# EAGLE design Hatch2021Badge0805_1 (EAGLE 9.6.2)
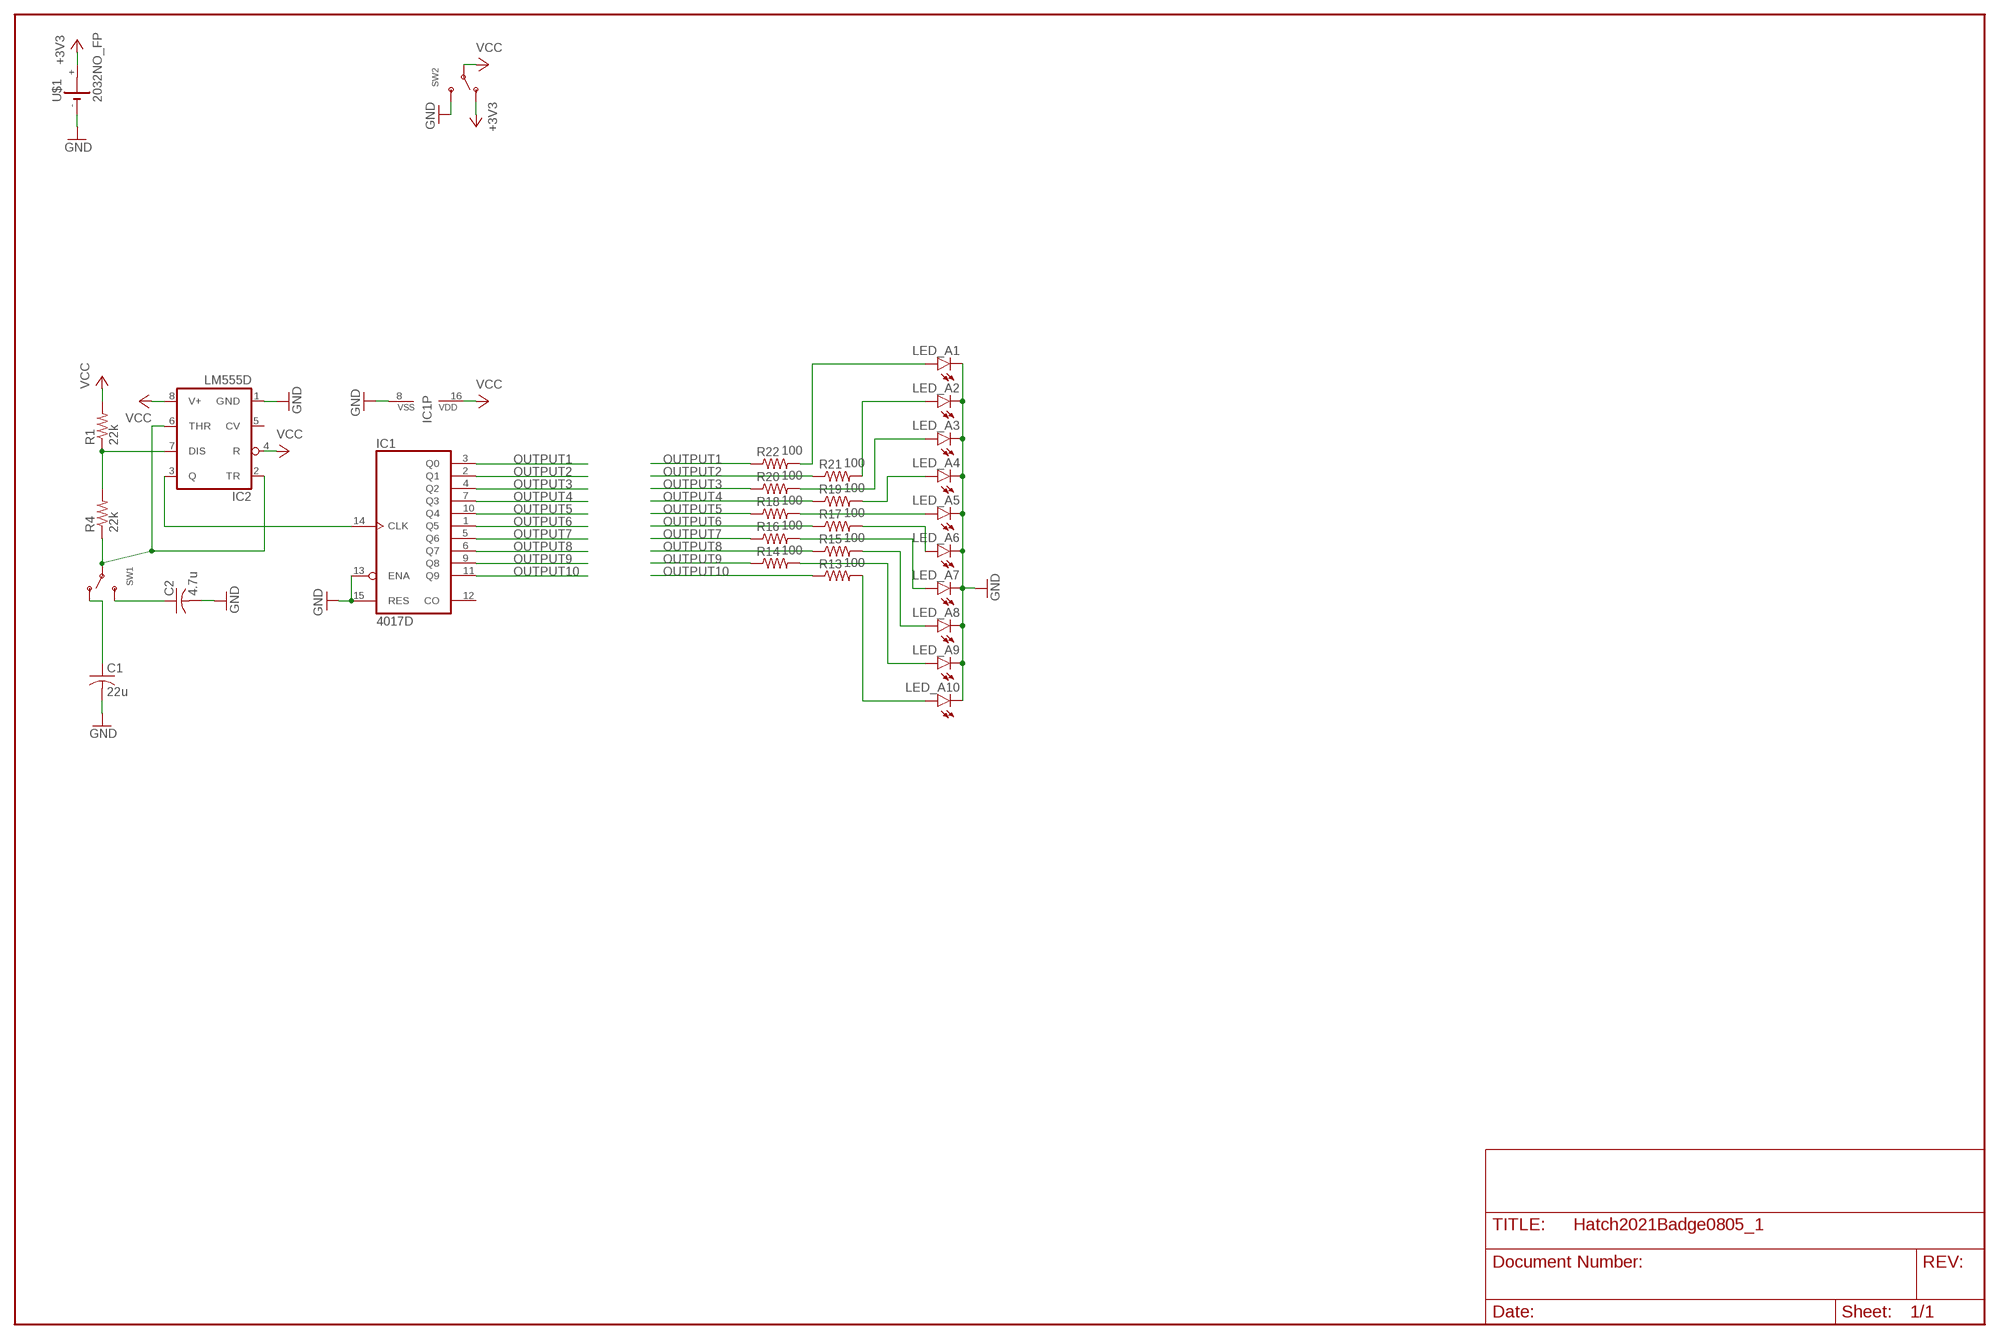
[diagram p0: schematic, sheet 1]

## Parts
C1  22u  C-USC0805  [C0805]
C2  4.7u  C-USC0805  [C0805]
IC1  4017D  [SO16]
IC2  LM555D  [SO08]
LED_A1  LEDSML0805  [SML0805]
LED_A2  LEDSML0805  [SML0805]
LED_A3  LEDSML0805  [SML0805]
LED_A4  LEDSML0805  [SML0805]
LED_A5  LEDSML0805  [SML0805]
LED_A6  LEDSML0805  [SML0805]
LED_A7  LEDSML0805  [SML0805]
LED_A8  LEDSML0805  [SML0805]
LED_A9  LEDSML0805  [SML0805]
LED_A10  LEDSML0805  [SML0805]
R1  22k  R-US_R0805  [R0805]
R4  22k  R-US_R0805  [R0805]
R13  100  R-US_R0805  [R0805]
R14  100  R-US_R0805  [R0805]
R15  100  R-US_R0805  [R0805]
R16  100  R-US_R0805  [R0805]
R17  100  R-US_R0805  [R0805]
R18  100  R-US_R0805  [R0805]
R19  100  R-US_R0805  [R0805]
R20  100  R-US_R0805  [R0805]
R21  100  R-US_R0805  [R0805]
R22  100  R-US_R0805  [R0805]
SW1  SWITCH_SPDT  [SPDT_SMT_SSSS811101]
SW2  SWITCH_SPDT  [SPDT_SMT_SSSS811101]
U$1  2032NO_FP  [2032_NO_FP]

## Nets
+3V3 [5V]: SW2.A(O) U$1.+
GND [5V]: C1.2 C2.2 IC1.8(VSS) IC1.13(ENA) IC1.15(RES) IC2.1(GND) LED_A1.C LED_A2.C LED_A3.C LED_A4.C LED_A5.C LED_A6.C LED_A7.C LED_A8.C LED_A9.C LED_A10.C SW2.C(S) U$1.-
N$1: IC2.7(DIS) R1.1 R4.2
N$2: LED_A2.A R21.2
N$3: LED_A3.A R20.2
N$4: C1.1 SW1.A(O)
N$5: C2.1 SW1.C(S)
N$15: LED_A1.A R22.2
N$16: LED_A4.A R19.2
N$17: LED_A5.A R18.2
N$18: LED_A6.A R17.2
N$19: LED_A7.A R16.2
N$20: LED_A8.A R15.2
N$21: LED_A9.A R14.2
N$22: LED_A10.A R13.2
N$67: IC2.2(TR) IC2.6(THR) R4.1 SW1.B(P)
N$68: IC1.14(CLK) IC2.3(Q)
OUTPUT1: IC1.3(Q0) R22.1
OUTPUT2: IC1.2(Q1) R21.1
OUTPUT3: IC1.4(Q2) R20.1
OUTPUT4: IC1.7(Q3) R19.1
OUTPUT5: IC1.10(Q4) R18.1
OUTPUT6: IC1.1(Q5) R17.1
OUTPUT7: IC1.5(Q6) R16.1
OUTPUT8: IC1.6(Q7) R15.1
OUTPUT9: IC1.9(Q8) R14.1
OUTPUT10: IC1.11(Q9) R13.1
VCC [5V]: IC1.16(VDD) IC2.4(R) IC2.8(V+) R1.2 SW2.B(P)
Unconnected: IC1.12(CO) IC2.5(CV)

## Library data of the parts
C1 C2 = rcl:C-US: CAPACITOR, American symbol; SPICEPREFIX: C
IC1 = 40xx:4017: COUNTER/DIVIDER
IC2 = adafruit:*555: TIMER Changed DIP package to have round (not oval) pin pads http://www.ladyada.net/library/pcb/eaglelibrary.html
LED_A1-LED_A10 = led:LED: LED OSRAM: - CHIPLED LG R971, LG N971, LY N971, LG Q971, LY Q971, LO R971, LY R971 LH N974, LH R974 LS Q976, LO Q976, LY Q976 LO Q996 - Hyper CHIPLED LW Q18S LB Q993, LB Q99A, LB R99A - SideLED LS A670, LO A670, LY A670, LG A670, LP A670 LB A673, LV A673, LT A673, LW A673 LH A674 LY A675 LS A676, LA A676, LO A676, LY A676, LW A676 LS A679, LY A679, LG A679 - Hyper Micro SIDELED® LS Y876, LA Y876, LO Y876, LY Y876 LT Y87S - SmartLED LW L88C, LW L88S LB L89C, LB L89S, LG L890 LS L89K, LO L89K, LY L89K LS L896, LA L896, LO L896, LY L896 - TOPLED LS T670, LO T670, LY T670, LG T670, LP T670 LSG T670, LSP T670, LSY T670, LOP T670, LYG T670 LG T671, LOG T671, LSG T671 LB T673, LV T673, LT T673, LW T673 LH T674 LS T676, LA T676, LO T676, LY T676, LB T676, LH T676, LSB T676, LW T676 LB T67C, LV T67C, LT T67C, LS T67K, LO T67K, LY T67K, LW E67C LS E67B, LA E67B, LO E67B, LY E67B, LB E67C, LV E67C, LT E67C LW T67C LS T679, LY T679, LG T679 LS T770, LO T770, LY T770, LG T770, LP T770 LB T773, LV T773, LT T773, LW T773 LH T774 LS E675, LA E675, LY E675, LS T675 LS T776, LA T776, LO T776, LY T776, LB T776 LHGB T686 LT T68C, LB T68C - Hyper Mini TOPLED® LB M676 - Mini TOPLED Santana® LG M470 LS M47K, LO M47K, LY M47K Source: http://www.osram.convergy.de LUXEON: - LUMILED® LXK2-PW12-R00, LXK2-PW12-S00, LXK2-PW14-U00, LXK2-PW14-V00 LXK2-PM12-R00, LXK2-PM12-S00, LXK2-PM14-U00 LXK2-PE12-Q00, LXK2-PE12-R00, LXK2-PE12-S00, LXK2-PE14-T00, LXK2-PE14-U00 LXK2-PB12-K00, LXK2-PB12-L00, LXK2-PB12-M00, LXK2-PB14-N00, LXK2-PB14-P00, LXK2-PB14-Q00 LXK2-PR12-L00, LXK2-PR12-M00, LXK2-PR14-Q00, LXK2-PR14-R00 LXK2-PD12-Q00, LXK2-PD12-R00, LXK2-PD12-S00 LXK2-PH12-R00, LXK2-PH12-S00 LXK2-PL12-P00, LXK2-PL12-Q00, LXK2-PL12-R00 Source: www.luxeon.com KINGBRIGHT: KA-3528ASYC Source: www.kingbright.com
R1 R4 R13-R22 = rcl:R-US_: RESISTOR, American symbol; SPICEPREFIX: R
SW1 SW2 = microbuilder:SWITCH_SPDT: Switch - SPDT SSSS811101 - Horizontal Two Position SMT, 0.3A 4V [Mouser: 688-SSSS811101]
U$1 = Hatch2020:2032

## Net classes
1 vee: width 0.508 mm
2 5V: width 0.508 mm

## Board
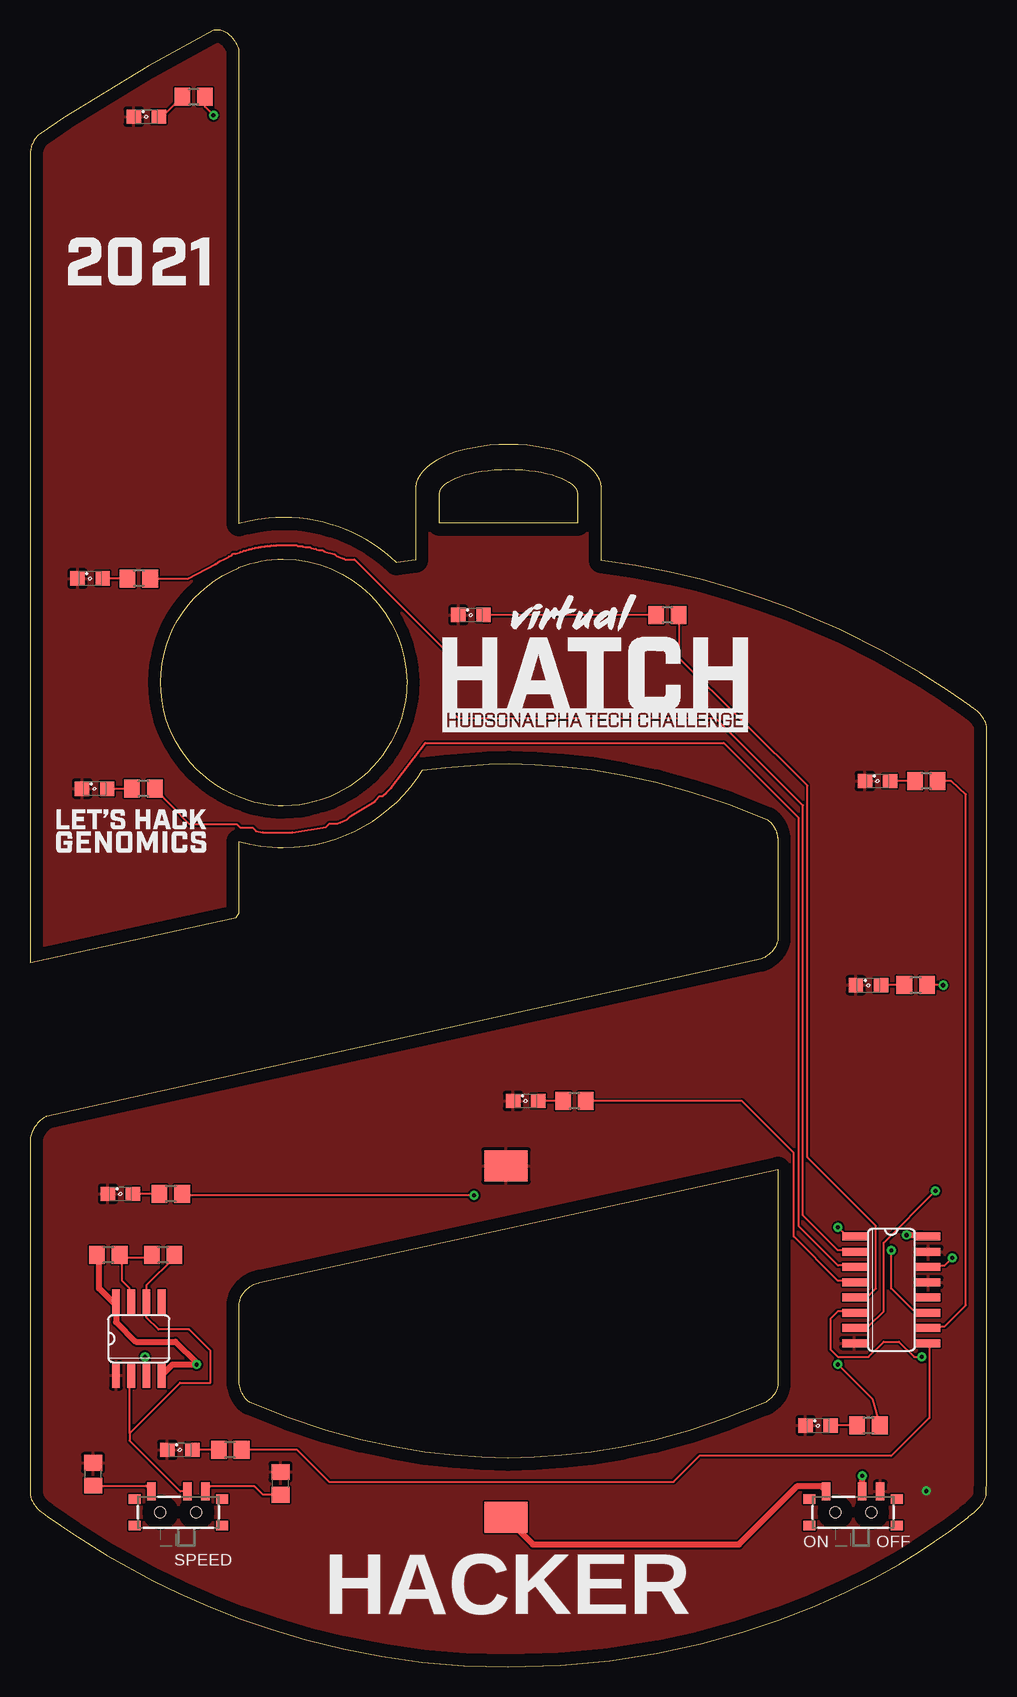
[diagram p1: board, top side]
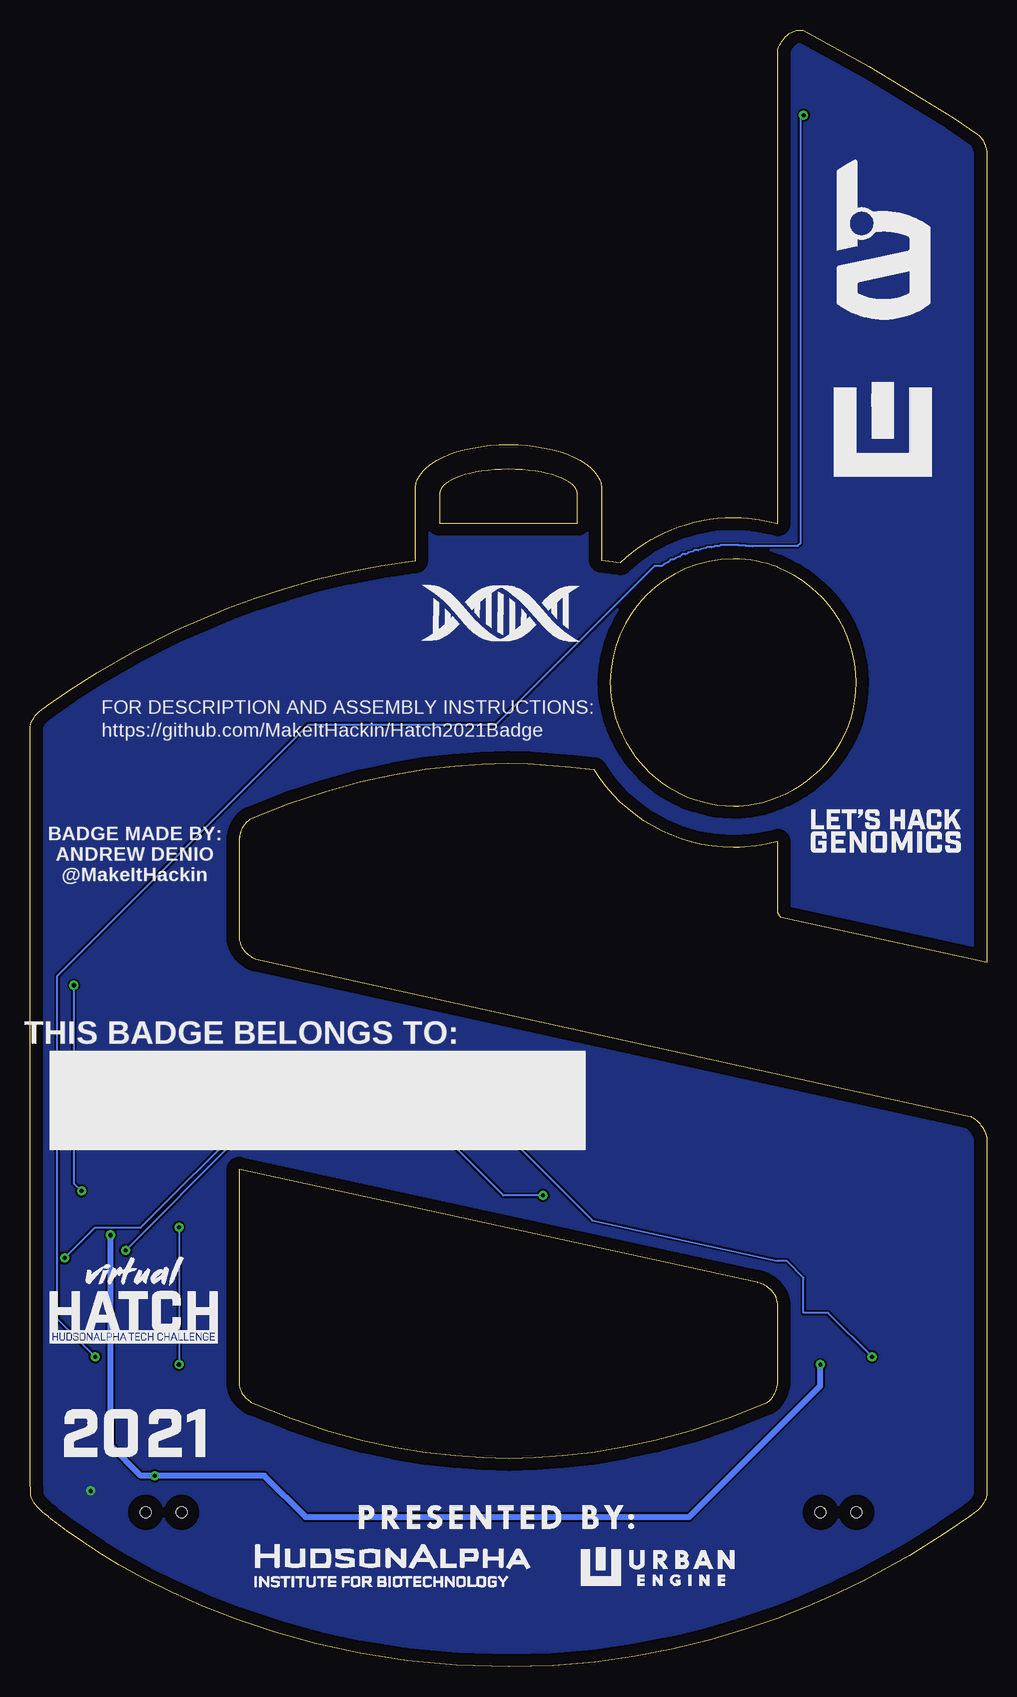
[diagram p2: board, bottom side, seen from below]

Size 79.79 x 136.46 mm. Coordinates in mm from the lower left corner, seen from the top.
Outline: 17.44,134.82 17.44,134.82 17.43,95.29 18.13,95.47 18.96,95.63 19.95,95.76 20.47,95.8 20.99,95.82 21.81,95.81 22.48,95.76 23.14,95.68 23.8,95.56 24.44,95.42 25.07,95.25 25.69,95.04 26.29,94.81 26.88,94.56 27.46,94.27 28.02,93.96 28.57,93.63 29.09,93.27 29.6,92.89 30.09,92.48 30.56,92.06 32.16,92.26 32.16,98.3 32.2,98.67 32.32,99.03 32.51,99.37 32.77,99.7 33.1,100.02 33.48,100.32 33.93,100.59 34.43,100.85 34.98,101.08 35.57,101.29 36.21,101.47 36.89,101.62 37.6,101.74 38.34,101.83 39.1,101.89 39.89,101.91 40.68,101.89 41.45,101.83 42.19,101.74 42.9,101.62 43.58,101.47 44.22,101.29 44.81,101.08 45.36,100.85 45.86,100.59 46.31,100.32 46.69,100.02 47.02,99.7 47.28,99.37 47.47,99.03 47.59,98.67 47.63,98.3 47.63,92.24 50.53,91.81 53.33,91.27 56,90.64 58.56,89.91 61,89.12 63.31,88.28 67.52,86.49 71.16,84.66 74.21,82.91 76.61,81.36 78.35,80.13 78.43,80.08 78.63,79.95 78.86,79.77 78.98,79.67 79.1,79.55 79.22,79.43 79.33,79.3 79.44,79.17 79.54,79.02 79.62,78.87 79.69,78.71 79.75,78.55 79.78,78.38 79.79,78.2 79.79,15.61 79.75,14.48 79.73,14.31 79.69,14.15 79.62,13.98 79.53,13.82 79.42,13.66 79.31,13.5 79.18,13.35 79.05,13.21 78.91,13.08 78.78,12.95 78.53,12.75 78.33,12.6 78.26,12.55 78.21,12.52 78.21,12.49 78.04,12.35 76.72,11.34 74.13,9.59 72.38,8.53 70.33,7.4 68,6.24 65.38,5.07 62.49,3.94 59.34,2.88 55.93,1.94 52.26,1.14 48.35,0.53 44.21,0.13 39.84,0 36.2,0.1 32.69,0.4 29.32,0.88 26.1,1.51 23.03,2.27 20.12,3.13 17.39,4.08 14.83,5.09 12.45,6.13 10.26,7.2 6.47,9.27 3.52,11.12 1.46,12.58 1.28,12.69 1.06,12.84 0.94,12.94 0.82,13.04 0.69,13.15 0.57,13.27 0.46,13.4 0.35,13.54 0.25,13.69 0.17,13.84 0.1,14 0.04,14.16 0.01,14.34 0,14.51 0,44.16 0.09,44.41 0.19,44.64 0.26,44.76 0.33,44.89 0.41,45.03 0.51,45.16 0.61,45.3 0.73,45.43 0.85,45.55 0.99,45.66 1.14,45.77 1.31,45.85 1.31,45.86 1.31,45.86 1.32,45.87 1.32,45.87 1.33,45.88 1.33,45.88 1.33,45.88 1.35,45.89 1.36,45.89 1.37,45.89 1.38,45.89 1.39,45.89 60.98,59.03 61.06,59.06 61.16,59.11 61.26,59.16 61.37,59.23 61.48,59.31 61.6,59.4 61.72,59.5 61.83,59.61 61.94,59.74 62.05,59.88 62.14,60.03 62.22,60.2 62.29,60.38 62.33,60.58 62.36,60.79 62.37,68.67 62.35,68.67 62.35,68.71 62.36,68.72 62.36,68.72 62.36,68.72 62.36,68.72 62.36,68.73 62.36,68.74 62.36,68.75 62.36,68.76 62.37,68.76 62.37,68.82 62.34,69.13 62.33,69.13 62.33,69.13 62.33,69.13 62.33,69.14 62.33,69.14 62.33,69.14 62.33,69.14 62.32,69.14 62.32,69.15 62.32,69.15 62.32,69.15 62.32,69.15 62.31,69.23 62.3,69.32 62.28,69.42 62.26,69.51 62.26,69.52 62.25,69.53 62.24,69.56 62.23,69.58 62.23,69.58 62.23,69.59 62.22,69.61 62.22,69.62 62.17,69.76 62.12,69.86 62.1,69.92 62.07,69.97 61.98,70.12 61.93,70.2 61.87,70.28 61.77,70.39 61.74,70.43 61.66,70.5 61.58,70.57 61.49,70.63 58.23,71.92 55.13,72.96 52.21,73.76 49.45,74.37 46.85,74.8 44.4,75.08 42.1,75.24 39.95,75.3 38.26,75.26 34.66,75 32.74,74.76 32.26,74.05 31.74,73.37 31.19,72.73 30.59,72.12 29.96,71.55 29.29,71.02 28.59,70.53 27.86,70.09 27.1,69.69 26.31,69.33 25.5,69.03 24.66,68.78 23.8,68.58 22.93,68.43 22.03,68.34 21.12,68.31 20.64,68.32 20.17,68.35 19.23,68.45 18.32,68.61 17.42,68.83 17.42,62.86 17.19,62.5 0.01,58.74 0,126.15 0.01,126.21 0.03,126.37 0.04,126.46 0.06,126.56 0.09,126.66 0.12,126.77 0.16,126.88 0.21,126.99 0.26,127.11 0.33,127.22 0.4,127.34 0.48,127.45 0.58,127.56 0.68,127.67 0.79,127.77 2.8,129.16 9.85,133.43 15.3,136.44 15.42,136.46 15.54,136.46 15.66,136.45 15.77,136.44 15.88,136.42 15.99,136.39 16.09,136.35 16.19,136.31 16.28,136.27 16.37,136.22 16.46,136.17 16.54,136.11 16.62,136.05 16.7,135.98 16.77,135.92 16.83,135.85 16.9,135.78 16.97,135.7 17.03,135.62 17.09,135.53 17.19,135.37 17.27,135.21 17.34,135.07 17.38,134.96 17.42,134.86 17.42,134.86 17.43,134.85 17.43,134.85 17.43,134.84 17.43,134.84 17.44,134.83 17.44,134.83 17.44,134.83 17.44,134.83 17.44,134.82 17.44,134.82
Outline: 17.44,134.82 17.44,134.82
Outline: 34.15,97.81 34.18,98.01 34.27,98.22 34.41,98.41 34.6,98.6 34.84,98.77 35.13,98.94 35.46,99.1 35.83,99.24 36.24,99.37 36.68,99.49 37.16,99.59 37.66,99.68 38.19,99.75 38.74,99.8 39.31,99.83 39.89,99.84 40.48,99.83 41.05,99.8 41.6,99.75 42.13,99.68 42.63,99.59 43.11,99.49 43.55,99.37 43.96,99.24 44.33,99.1 44.66,98.94 44.95,98.77 45.19,98.6 45.38,98.41 45.52,98.22 45.61,98.01 45.64,97.81 45.64,95.35 34.15,95.35 34.15,97.81
Outline: 29.74,76.5 29.39,75.98 29,75.49 28.58,75.02 28.13,74.57 27.66,74.16 27.17,73.77 26.65,73.41 26.1,73.09 25.54,72.79 24.96,72.54 24.36,72.31 23.74,72.13 23.11,71.98 22.46,71.87 21.8,71.8 21.12,71.78 20.69,71.79 20.26,71.82 19.84,71.86 19.42,71.93 18.75,72.08 18.09,72.27 17.45,72.5 16.82,72.77 16.18,73.1 15.57,73.48 14.98,73.89 14.42,74.34 13.9,74.83 13.41,75.35 12.96,75.9 12.55,76.49 12.18,77.1 11.85,77.74 11.57,78.41 11.33,79.1 11.14,79.81 11,80.54 10.92,81.29 10.89,82.06 10.92,82.86 11.02,83.66 11.17,84.43 11.38,85.18 11.64,85.9 11.95,86.6 12.32,87.27 12.73,87.91 13.18,88.52 13.68,89.09 14.22,89.62 14.79,90.11 15.4,90.56 16.05,90.96 16.72,91.32 17.42,91.63 17.42,91.67 17.86,91.82 18.3,91.96 18.75,92.08 19.21,92.18 19.68,92.26 20.16,92.32 20.64,92.35 21.12,92.36 22.17,92.31 23.19,92.15 24.18,91.89 25.12,91.55 26.02,91.11 26.87,90.6 27.66,90.01 28.39,89.34 29.05,88.61 29.65,87.82 30.16,86.97 30.6,86.07 30.95,85.13 31.2,84.14 31.36,83.12 31.42,82.07 31.41,81.68 31.39,81.3 31.35,80.93 31.3,80.56 31.24,80.19 31.16,79.83 31.07,79.47 30.97,79.12 30.86,78.77 30.73,78.43 30.44,77.76 30.12,77.12 29.74,76.5
Outline: 62.37,23.87 62.36,23.67 62.34,23.48 62.31,23.31 62.26,23.14 62.2,22.99 62.13,22.85 62.04,22.72 61.95,22.6 61.86,22.48 61.76,22.38 61.66,22.29 61.55,22.21 61.45,22.14 61.35,22.07 61.25,22.02 61.16,21.97 57.96,20.71 54.93,19.7 52.05,18.91 49.33,18.32 46.75,17.9 44.32,17.63 42.01,17.47 39.84,17.41 37.69,17.47 35.39,17.63 32.94,17.91 30.34,18.34 27.58,18.94 24.66,19.75 21.57,20.78 18.3,22.07 18.13,22.21 17.99,22.35 17.86,22.51 17.76,22.67 17.67,22.83 17.6,22.99 17.55,23.15 17.51,23.31 17.48,23.46 17.46,23.6 17.44,23.72 17.43,23.92 17.43,23.99 17.43,24.04 17.42,24.04 17.42,30.05 17.43,30.05 17.45,30.33 17.5,30.58 17.58,30.8 17.67,31.01 17.79,31.19 17.92,31.35 18.07,31.49 18.22,31.61 18.37,31.71 18.52,31.8 18.66,31.87 18.79,31.93 18.91,31.98 19.08,32.04 19.13,32.05 62.37,41.49 62.37,23.87
Copper layers (1*16): Top 0.035mm / dielectric 1.5mm / Bottom 0.035mm
Design rules "default *": minimum track width 6mil, minimum drill 0.35mm, track to track 6mil, track to pad 6mil, pad to pad 6mil, via to via 6mil, smd to smd 6mil, copper to edge 40mil, drill to drill 6mil, minimum pad ring 10mil, minimum via ring 8mil, stop-mask expansion 4mil, vias tented up to drill 15mil, thermal gap 10mil
vRestrict: area 4.6,112 to 12.8,125.8; area 2.5,114.9 to 15.8,119.3; area 4.2,99 to 12.9,107.6; area -22.3,104.1 to -14,110.8; area 2,67.6 to 14.9,71.8; area 29.4,11.2 to 53.1,13.8; area 20.8,6.8 to 34.2,10.4; area 37.9,6.3 to 61.1,10.5; area 20,3.1 to 62.3,15.1; area 33.8,85.4 to 47.2,90.4; area 63.9,17.3 to 77.3,21.8

### Footprints (pad centres in the part's own frame; a part is rotated, then mirrored left to right if it is on the bottom)
C0805 = smd 1.3 x 1.5: 1 -0.95,0; 2 0.95,0
SO16 = smd 0.66 x 2.032: 1 -4.445,-3.073; 2 -3.175,-3.073; 3 -1.905,-3.073; 4 -0.635,-3.073; 5 0.635,-3.073; 6 1.905,-3.073; 7 3.175,-3.073; 8 4.445,-3.073; 9 4.445,3.073; 10 3.175,3.073; 11 1.905,3.073; 12 0.635,3.073; 13 -0.635,3.073; 14 -1.905,3.073; 15 -3.175,3.073; 16 -4.445,3.073
SO08 = smd 0.66 x 2.032: 1 -1.905,-3.073; 2 -0.635,-3.073; 3 0.635,-3.073; 4 1.905,-3.073; 5 1.905,3.073; 6 0.635,3.073; 7 -0.635,3.073; 8 -1.905,3.073
SML0805 = smd 1.2 x 1.2: A 1.05,0; C -1.05,0
R0805 = smd 1.3 x 1.5: 1 -0.95,0; 2 0.95,0
SPDT_SMT_SSSS811101 = smd 0.7 x 1.5: A -2.25,1.75; B 0.75,1.75; C 2.25,1.75 | smd 1 x 0.8: SUP1 -3.65,1.1; SUP2 -3.65,-1.1; SUP3 3.65,1.1; SUP4 3.65,-1.1 | hole 0.9: -1.5,0; 1.5,0
2032_NO_FP = smd 2.6 x 3.6: + 14.65,0; - -14.65,0

### Placement (x,y rotation side)
C1  5.26,16.07 90 top
C2  20.88,15.31 90 top
IC1  71.81,31.43 270 top
IC2  9.07,27.37 0 top
LED_A1  5.39,73.22 0 top
LED_A2  5.01,90.74 0 top
LED_A3  41.33,47.18 0 top
LED_A4  69.91,56.83 0 top
LED_A5  70.67,73.85 0 top
LED_A6  65.71,20.13 0 top
LED_A7  36.76,87.7 0 top
LED_A8  9.71,129.22 0 top
LED_A9  12.5,18.1 0 top
LED_A10  7.55,39.44 0 top
R1  6.53,34.36 180 top
R4  11.1,34.36 180 top
R13  11.74,39.44 180 top
R14  16.69,18.1 180 top
R15  13.64,130.88 180 top
R16  53.14,87.7 180 top
R17  69.91,20.13 180 top
R18  74.73,73.85 180 top
R19  73.84,56.83 180 top
R20  45.39,47.18 180 top
R21  9.07,90.74 180 top
R22  9.45,73.22 180 top
SW1  12.37,12.89 0 top
SW2  68.64,12.89 0 top
U$1  39.68,27.12 270 top

### Tracks (layer width: path | path; a pad name or v marks a point on that pad's centre or on a via)
+3V3
  Top 0.508: U$1.+ 41.92,10.23 59.11,10.23 63.94,15.05 65.98,15.05 SW2.A
GND  (via drill 0.35)
  other vias: 74.73,14.67
  pour Top: -8.83,138.24 -8.83,-2.73 85.15,-2.73 85.15,138.24
  pour Bottom: -10.1,139.51 -10.1,-4 83.24,-4 83.24,139.51
N$1
  Top 0.152: R4.2 10.09,34.1 7.68,34.1 7.68,33.61 | 7.68,33.61 7.68,32.2 8.31,31.56 8.31,30.93 IC2.7 | 7.68,33.61 R1.1
N$2
  Top 0.152: R21.2 LED_A2.A
N$3
  Top 0.152: R20.2 LED_A3.A
N$4
  Top 0.152: C1.1 9.65,15.12 SW1.A
N$5
  Top 0.152: 20.66,14.13 C2.1 19.42,14.36 18.72,15.05 15.03,15.05 SW1.C
N$15
  Top 0.152: LED_A1.A R22.2
N$16
  Top 0.152: R19.2 LED_A4.A
N$17
  Top 0.152: R18.2 LED_A5.A
N$18
  Top 0.152: R17.2 LED_A6.A
N$19
  Top 0.152: R16.2 LED_A7.A
N$20
  Top 0.152: R15.2 11.16,129.34 LED_A8.A
N$21
  Top 0.152: R14.2 LED_A9.A
N$22
  Top 0.152: R13.2 LED_A10.A
N$67
  Top 0.152: 8.31,19.5 8.31,18.86 12.53,14.64 SW1.B | 8.31,19.5 8.31,23.94 IC2.2 | 8.31,19.5 12.5,23.69 15.04,23.69 15.04,26.35 13.26,28.13 10.72,28.13 9.71,29.15 IC2.6 9.71,31.82 12.05,34.16 R4.1
N$68  (via drill 0.35)
  Top 0.152: v9.58,25.85 9.58,24.58 IC2.3 | v76.89,34.1 76.26,33.47 74.99,33.47 IC1.14
  Bottom 0.152: v76.89,34.1 74.35,36.64 70.54,36.64 61.52,45.66 41.33,45.66 32.9,37.23 17.48,33.86 17.46,33.86 16.7,33.86 15.3,32.45 15.3,29.53 13.26,29.53 v9.58,25.85
OUTPUT1
  Top 0.152: R22.1 13.29,70.23 17.26,70.23 17.52,69.98 17.56,69.97 18.54,69.97 18.84,69.67 19.39,69.58 19.4,69.58 21.86,69.58 21.89,69.55 24.67,70.01 24.96,70.3 25.62,70.3 25.87,70.39 26.44,70.65 26.73,70.93 28.8,72.19 28.8,72.22 29.16,72.58 29.39,72.58 29.74,72.9 30.11,73.27 30.11,73.29 32.98,77.03 57.84,77.03 64.06,70.8 64.06,36.77 67.37,33.47 68.64,33.47 IC1.3
OUTPUT2
  Top 0.152: IC1.2 68.64,34.74 67.37,34.74 64.44,37.66 64.44,71.82 57.21,79.06 35.74,79.06 35.11,79.69 35.11,84.27 27.05,92.32 26.26,92.32 26.22,92.36 25.57,92.6 25.41,92.76 25.39,92.76 | 25.39,92.76 24.52,92.99 24.4,93.1 24.07,93.1 23.88,93.15 23.84,93.21 23.43,93.27 23.36,93.34 22.97,93.34 22.75,93.37 22.71,93.42 22.29,93.45 22.23,93.51 20.69,93.51 20.68,93.5 20.58,93.49 20.51,93.49 20.32,93.49 20.31,93.49 20.13,93.48 20.11,93.46 20.05,93.45 19.98,93.45 19.79,93.45 19.78,93.43 19.6,93.42 19.58,93.4 19.52,93.39 19.46,93.38 19.29,93.38 19.26,93.36 19.08,93.34 19.06,93.32 19,93.3 18.94,93.29 18.78,93.29 18.74,93.26 18.56,93.23 18.54,93.21 18.49,93.19 18.44,93.18 18.28,93.18 18.23,93.14 18.05,93.1 18.04,93.08 17.99,93.06 17.94,93.05 17.79,93.05 17.74,93 17.55,92.95 17.54,92.92 17.49,92.91 17.18,92.81 16.95,92.81 16.8,92.65 16.59,92.58 16.57,92.53 16.22,92.35 15.84,92.18 15.83,92.18 15.83,92.17 15.47,91.95 13.19,90.74 R21.1 | 25.39,92.76
OUTPUT3
  Top 0.152: R20.1 59.36,47.18 63.68,42.86 63.68,35.88 67.37,32.2 68.64,32.2 IC1.4
OUTPUT4  (via drill 0.35)
  Top 0.152: v75.49,39.69 71.18,35.37 71.18,29.66 69.91,28.39 69.27,28.39 IC1.7 | v76.13,56.83 R19.1
  Bottom 0.152: v76.13,56.83 76.13,40.32 v75.49,39.69
OUTPUT5
  Top 0.152: R18.1 76.81,73.85 78.03,72.74 78.03,30.16 76.26,28.39 74.99,28.39 IC1.10
OUTPUT6  (via drill 0.35)
  Top 0.152: v67.37,25.21 70.21,22.36 R17.1 | v67.37,36.64 68,36.01 68.64,36.01 IC1.1
  Bottom 0.152: v67.37,36.64 v67.37,25.21
OUTPUT7
  Top 0.152: R16.1 54.09,84.09 64.83,73.47 64.83,42.48 70.54,36.77 70.54,31.56 69.91,30.93 69.27,30.93 IC1.5
OUTPUT8  (via drill 0.35)
  Top 0.152: v74.35,25.85 73.72,25.85 72.45,27.12 71.18,27.12 69.91,25.85 67.37,25.85 66.73,26.48 66.73,29.02 67.37,29.66 68.64,29.66 IC1.6 | v15.3,129.35 14.59,130.05 R15.1
  Bottom 0.152: v15.3,129.35 15.55,129.1 15.55,93.66 15.79,93.42 19.6,93.42 19.78,93.43 19.79,93.45 19.98,93.45 20.05,93.45 20.11,93.46 20.13,93.48 20.31,93.49 20.32,93.49 20.51,93.49 20.58,93.49 20.68,93.5 20.69,93.51 22.23,93.51 22.29,93.45 22.71,93.42 22.75,93.37 22.97,93.34 23.36,93.34 23.43,93.27 23.84,93.21 23.88,93.15 24.07,93.1 24.4,93.1 24.52,92.99 24.92,92.88 24.96,92.83 25.13,92.76 25.41,92.76 25.57,92.6 25.96,92.46 25.99,92.4 26.15,92.32 26.37,92.32 26.57,92.12 26.94,91.94 26.97,91.88 27.11,91.79 27.71,91.79 40.95,78.55 56.57,78.55 77.53,57.6 77.53,29.02 v74.35,25.85
OUTPUT9
  Top 0.152: R14.1 22.28,18.1 24.95,15.43 53.65,15.43 55.81,17.59 71.81,17.59 74.99,20.77 74.99,27.12 IC1.9
OUTPUT10  (via drill 0.35)
  Top 0.152: v37.01,39.31 12.72,39.31 R13.1 | v71.81,34.74 71.81,31.56 73.72,29.66 74.35,29.66 IC1.11
  Bottom 0.152: v37.01,39.31 40.31,39.31 44.89,43.88 62.67,43.88 v71.81,34.74
VCC  (via drill 0.35)
  Top 0.508: R1.2 5.77,33.57 5.77,31.56 7.04,30.29 IC2.8 7.17,28.77 8.82,27.12 12.12,27.12 13.9,25.34 v13.9,25.21 11.89,25.21 IC2.4 | v73.08,36.01 74.35,36.01 IC1.16 | SW2.B 69.39,14.91 69.4,14.92 v69.4,15.94
  Bottom 0.508: v13.9,25.21 13.9,23.43 24.82,12.51 56.82,12.51 60.25,15.94 v69.4,15.94 70.54,15.94 73.08,18.48 v73.08,36.01

### Text on the board
tPlace: PROFESSIONAL | HIGH SCHOOL | 1st PLACE | 1st PLACE | PROFESSIONAL | 3rd PLACE | PROFESSIONAL | HIGH SCHOOL | 2nd PLACE | 2nd PLACE | MENTOR | SPONSOR | VOLUNTEER | SPEAKER | ORGANIZER | JUDGE | ON | OFF | SPEED | HACKER
bPlace: FOR DESCRIPTION AND ASSEMBLY INSTRUCTIONS: | https://github.com/MakeItHackin/Hatch2021Badge | BADGE MADE BY: / ANDREW DENIO / @MakeItHackin | THIS BADGE BELONGS TO:
tStop: 01101000 | 01110101 | 01100100 | 01110011 | 01101111 | 01101110 | 01100001 | 01101100 | 01110000 | 01101000 | 01100001 | 01000011 | AAGC | GTAT | 01000001 | CATA | GCCG | CGGC | GTAT | ATAT | 01010100 | TATA | 01010011 | 01010100 | GATTACACAT | 01000001 | 01010010 | 01001000 | 01010111 | 01000001 | 01000001 | 01000011 | CTGATCTAG | 01010010 | 01001011 | 01010011 | 01000101 | TGATCGAA | ATAT | 01010010 | TACGCTGG | ATGCGACC | GTAGTA | GACC | CATGCTCAG | TGAACT | TGCA
bStop: CATA | ATAC | CATCATCAT | TACA | ACAT | CATA | ATAC | GATTACACAT | ACAT | 01001110 | 01000101 | 00110100 | 01010010 | 01001100 | 01000100 | 01001001 | 01000110 | 01000101